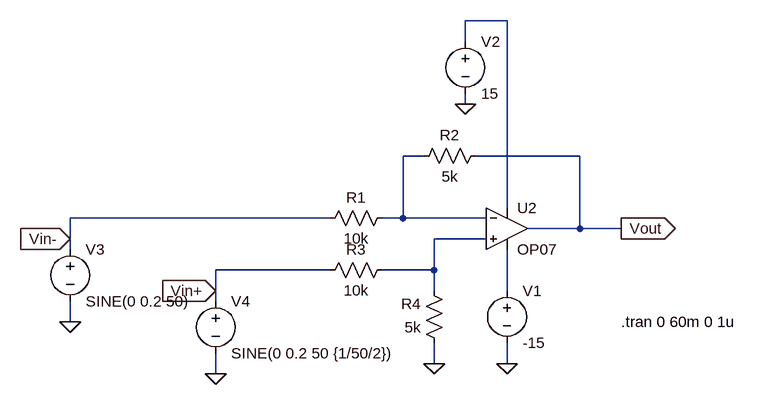
[diagram p0: schematic 003-difference-amplifier.asc]
003-difference-amplifier.asc, the LTspice schematic file:
Version 4
SHEET 1 880 680
WIRE 208 -96 144 -96
WIRE 144 -64 144 -96
WIRE 144 32 144 16
WIRE 80 112 48 112
WIRE 320 112 160 112
WIRE 208 192 208 -96
WIRE -64 208 -464 208
WIRE 48 208 48 112
WIRE 48 208 16 208
WIRE 176 208 48 208
WIRE 320 224 320 112
WIRE 320 224 240 224
WIRE 384 224 320 224
WIRE -464 240 -464 208
WIRE 176 240 96 240
WIRE -464 256 -464 240
WIRE -64 288 -240 288
WIRE 96 288 96 240
WIRE 96 288 16 288
WIRE -240 320 -240 288
WIRE 96 320 96 288
WIRE 208 320 208 256
WIRE -240 336 -240 320
WIRE -464 368 -464 336
WIRE 96 432 96 400
WIRE 208 432 208 400
WIRE -240 448 -240 416
FLAG 208 432 0
FLAG 144 32 0
FLAG -464 240 Vin-
IOPIN -464 240 In
FLAG 384 224 Vout
IOPIN 384 224 Out
FLAG -464 368 0
FLAG 96 432 0
FLAG -240 320 Vin+
IOPIN -240 320 In
FLAG -240 448 0
SYMBOL voltage 208 304 R0
SYMATTR InstName V1
SYMATTR Value -15
SYMBOL voltage 144 -80 R0
SYMATTR InstName V2
SYMATTR Value 15
SYMBOL res 32 192 R90
WINDOW 0 0 56 VBottom 2
WINDOW 3 32 56 VTop 2
SYMATTR InstName R1
SYMATTR Value 10k
SYMBOL res 176 96 R90
WINDOW 0 0 56 VBottom 2
WINDOW 3 32 56 VTop 2
SYMATTR InstName R2
SYMATTR Value 5k
SYMBOL voltage -464 240 R0
WINDOW 123 0 0 Left 2
WINDOW 39 0 0 Left 2
SYMATTR InstName V3
SYMATTR Value SINE(0 0.2 50)
SYMBOL res 32 272 R90
WINDOW 0 0 56 VBottom 2
WINDOW 3 32 56 VTop 2
SYMATTR InstName R3
SYMATTR Value 10k
SYMBOL res 112 416 R180
WINDOW 0 36 76 Left 2
WINDOW 3 36 40 Left 2
SYMATTR InstName R4
SYMATTR Value 5k
SYMBOL Opamps\\OP07 208 160 R0
SYMATTR InstName U2
SYMBOL voltage -240 320 R0
WINDOW 123 0 0 Left 2
WINDOW 39 0 0 Left 2
SYMATTR InstName V4
SYMATTR Value SINE(0 0.2 50 {1/50/2})
TEXT 384 368 Left 2 !.tran 0 60m 0 1u

The netlist it stands for:
* 003-difference-amplifier.asc
V1 N004 0 -15
V2 N001 0 15
R1 N002 Vin- 10k
R2 Vout N002 5k
V3 Vin- 0 SINE(0 0.2 50)
R3 N003 Vin+ 10k
R4 0 N003 5k
XU2 N003 N002 N001 N004 Vout LT1001  ; OP07, pins In+ In- V+ V- OUT
V4 Vin+ 0 SINE(0 0.2 50 {1/50/2})
.tran 0 60m 0 1u
.lib LTC.lib
.backanno
.end